# EAGLE schematic tutorial (EAGLE 6.2)
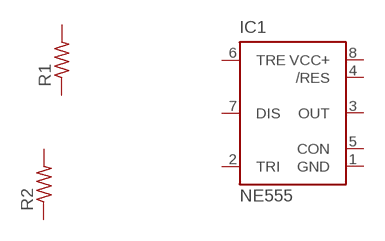
[diagram p0: schematic, sheet 1]

## Parts
IC1  NE555  [DIL-08]
R1  R-US_0207/10  [0207/10]
R2  R-US_0207/10  [0207/10]
Unconnected: IC1.2(TRI) IC1.3(OUT) IC1.4(/RES) IC1.5(CON) IC1.6(TRE) IC1.7(DIS) R1.1 R1.2 R2.1 R2.2

## Power pins joined to a net without a drawn wire
GND: IC1.1(GND)
VCC+: IC1.8(VCC+)

## Library data of the parts
IC1 = st-microelectronics:NE555: General purpose bipolar Timer; MF: Arrow Electronics; MPN: NE555N; OC_FARNELL: 1467742; OC_NEWARK: 89K1486
R1 R2 = rcl:R-US_: RESISTOR, American symbol